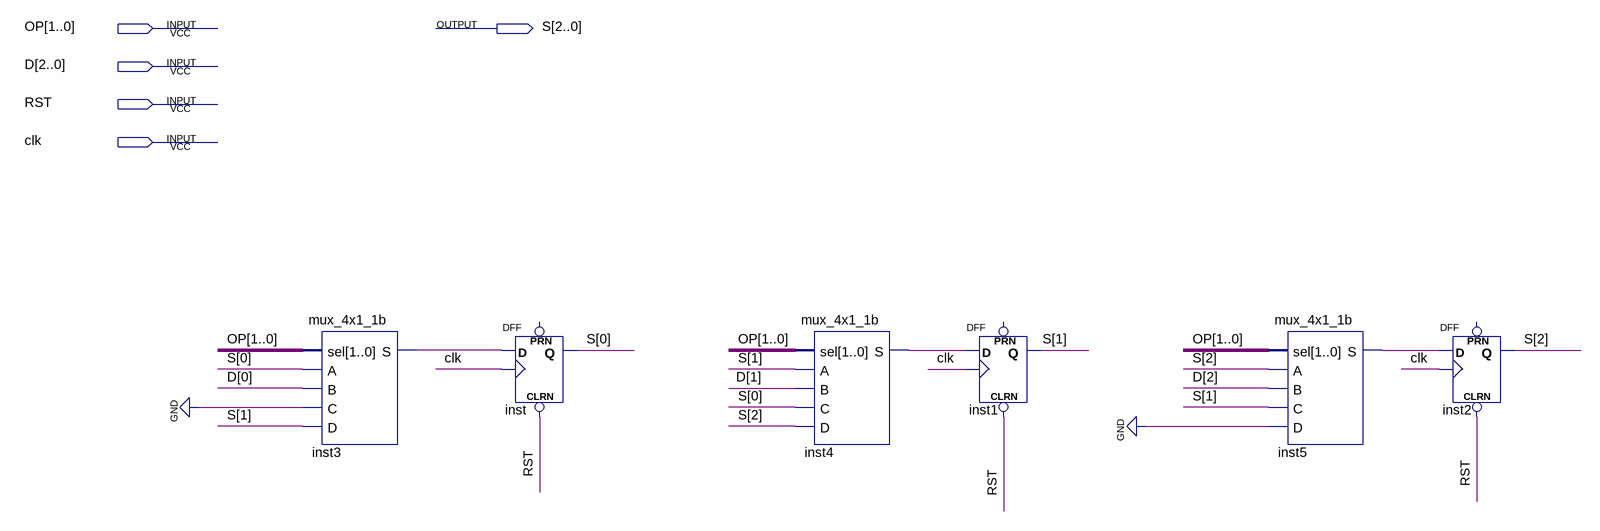
[diagram p0: schematic sheet]
// Quartus schematic contador_shift.bdf as structural Verilog: 6 symbols, 5 pins
module contador_shift (
  input  [1:0] OP,
  input  [2:0] D,
  input  RST,
  input  clk,
  output [2:0] S
);

  wire inst3_s, inst4_s, inst5_s;

  mux_4x1_1b inst3 (.sel(OP), .A(S[0]), .B(D[0]), .C(1'b0), .D(S[1]), .S(inst3_s));
  DFF inst (.CLRN(RST), .CLK(clk), .D(inst3_s), .Q(S[0]));  // open: PRN
  mux_4x1_1b inst4 (.sel(OP), .A(S[1]), .B(D[1]), .C(S[0]), .D(S[2]), .S(inst4_s));
  DFF inst1 (.CLRN(RST), .CLK(clk), .D(inst4_s), .Q(S[1]));  // open: PRN
  mux_4x1_1b inst5 (.sel(OP), .A(S[2]), .B(D[2]), .C(S[1]), .D(1'b0), .S(inst5_s));
  DFF inst2 (.CLRN(RST), .CLK(clk), .D(inst5_s), .Q(S[2]));  // open: PRN
endmodule
